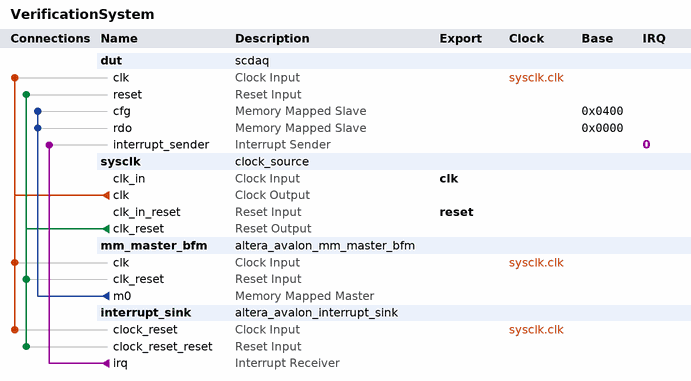
[diagram p0: system contents]
# Platform Designer (Qsys) system VerificationSystem, Cyclone II EP2C35F672C6
# Parameters at their usual value, and those the tool derives, are not listed.
package require -exact qsys 13.0
create_system VerificationSystem
set_project_property DEVICE_FAMILY {Cyclone II}
set_project_property DEVICE EP2C35F672C6

add_instance dut scdaq 1.0
set_instance_parameter_value dut NSAMPLES 256
set_instance_parameter_value dut PRECISION 14
set_instance_parameter_value dut NCTPSAMPLES 8
set_instance_parameter_value dut RDO_ADD_BLEN 8
set_instance_parameter_value dut CFG_ADD_BLEN 5

add_instance sysclk clock_source 13.0
set_instance_parameter_value sysclk clockFrequency 50000000

add_instance mm_master_bfm altera_avalon_mm_master_bfm 13.0
set_instance_parameter_value mm_master_bfm AV_ADDRESS_W 32
set_instance_parameter_value mm_master_bfm AV_NUMSYMBOLS 4
set_instance_parameter_value mm_master_bfm AV_BURSTCOUNT_W 3
set_instance_parameter_value mm_master_bfm AV_READRESPONSE_W 8
set_instance_parameter_value mm_master_bfm AV_WRITERESPONSE_W 8
set_instance_parameter_value mm_master_bfm USE_READ 1
set_instance_parameter_value mm_master_bfm USE_BYTE_ENABLE 1
set_instance_parameter_value mm_master_bfm USE_BURSTCOUNT 1
set_instance_parameter_value mm_master_bfm USE_READ_DATA 1
set_instance_parameter_value mm_master_bfm USE_READ_DATA_VALID 1
set_instance_parameter_value mm_master_bfm USE_WAIT_REQUEST 1
set_instance_parameter_value mm_master_bfm AV_CONSTANT_BURST_BEHAVIOR 1
set_instance_parameter_value mm_master_bfm AV_BURST_LINEWRAP 1
set_instance_parameter_value mm_master_bfm AV_BURST_BNDR_ONLY 1
set_instance_parameter_value mm_master_bfm AV_MAX_PENDING_READS 10
set_instance_parameter_value mm_master_bfm AV_FIX_READ_LATENCY 1
set_instance_parameter_value mm_master_bfm AV_READ_WAIT_TIME 1
set_instance_parameter_value mm_master_bfm ADDRESS_UNITS SYMBOLS
set_instance_parameter_value mm_master_bfm VHDL_ID 0

add_instance interrupt_sink altera_avalon_interrupt_sink 13.0
set_instance_parameter_value interrupt_sink ASSERT_HIGH_IRQ 1
set_instance_parameter_value interrupt_sink AV_IRQ_W 1
set_instance_parameter_value interrupt_sink ASYNCHRONOUS_INTERRUPT 0
set_instance_parameter_value interrupt_sink VHDL_ID 0

# connections
add_connection sysclk.clk dut.clk clock
add_connection sysclk.clk interrupt_sink.clock_reset clock
add_connection sysclk.clk mm_master_bfm.clk clock
add_connection sysclk.clk_reset dut.reset reset
add_connection sysclk.clk_reset interrupt_sink.clock_reset_reset reset
add_connection sysclk.clk_reset mm_master_bfm.clk_reset reset
add_connection mm_master_bfm.m0 dut.cfg avalon
set_connection_parameter_value mm_master_bfm.m0/dut.cfg baseAddress 0x0400
add_connection mm_master_bfm.m0 dut.rdo avalon
set_connection_parameter_value mm_master_bfm.m0/dut.rdo baseAddress 0x0000
add_connection interrupt_sink.irq dut.interrupt_sender interrupt
set_connection_parameter_value interrupt_sink.irq/dut.interrupt_sender irqNumber 0

# exported interfaces
add_interface clk clock sink
set_interface_property clk EXPORT_OF sysclk.clk_in
add_interface reset reset sink
set_interface_property reset EXPORT_OF sysclk.clk_in_reset

set_interconnect_requirement {$system} qsys_mm.clockCrossingAdapter HANDSHAKE
set_interconnect_requirement {$system} qsys_mm.maxAdditionalLatency 1

save_system VerificationSystem.qsys
